# Altium schematic sheet SmartTokens Microcontroller.SchDoc: SmartTokens - Microcontroller
size A4; Author: Mathieu Le Goc; CompanyName: Inria - Aviz; DocumentNumber: 1; Revision: v1.0; SheetNumber: 1; SheetTotal: 2; PageSetup: Record=PageOptions|CenterHorizontal=True|CenterVertical=True|PrintScale=1.04|XCorrection=1.00|YCorrection=1.00|PrintKind=1|BorderSize=5000000|LeftOffset=0|BottomOffset=0|Orientation=2|PaperLength=1000|PaperWidth=1000|Scale=100|PaperSource=7|PrintQuality=-4|MediaType=1|DitherType=10|PrintScaleMode=1|PaperKind=A4|PaperIndex=9; ProjectName: SmartTokens
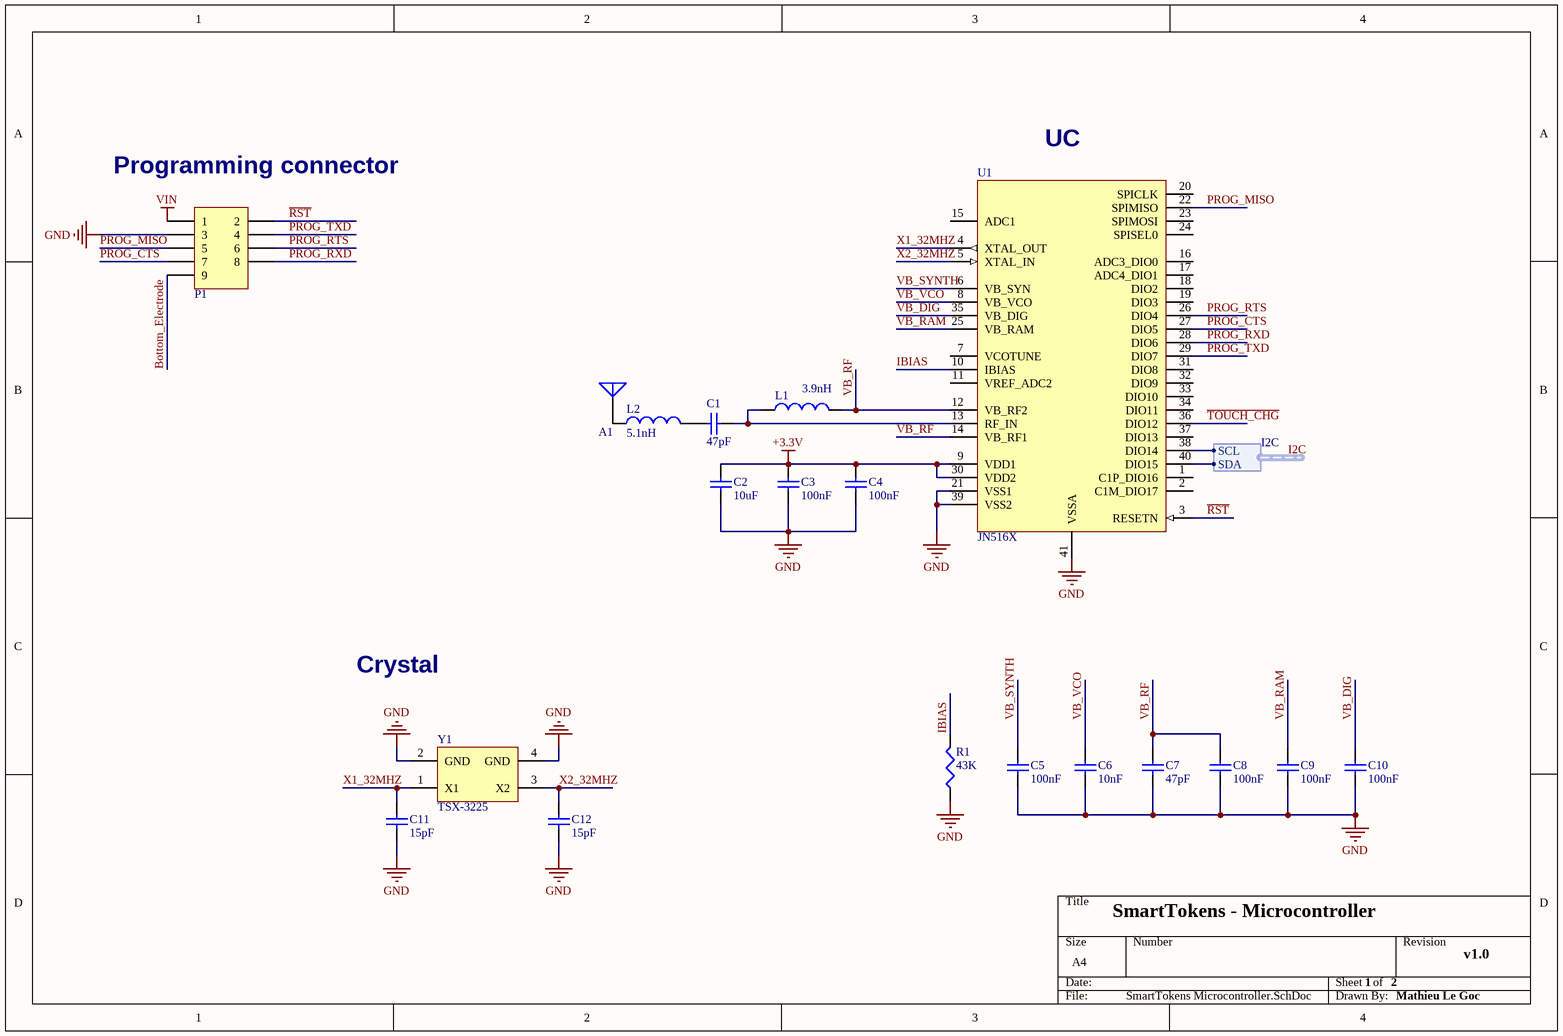
[diagram p0: SmartTokens Microcontroller.SchDoc]

## Parts
A1  2450AT18A100  [2450AT18A100]  (value not drawn)
C1  value 47pF  [0402]  (hidden comment: 47pF 0402 NP0 50V ±5%)
C2  value 10uF  [0603]  (hidden comment: 10uF 0603 X5R 6.3V ±20%)
C3  value 100nF  [0402]  (hidden comment: 100nF 0402 X7R 16V ±10%)
C4  value 100nF  [0402]  (hidden comment: 100nF 0402 X7R 16V ±10%)
C5  value 100nF  [0402]  (hidden comment: 100nF 0402 X7R 16V ±10%)
C6  10nF  [0402]
C7  value 47pF  [0402]  (hidden comment: 47pF 0402 NP0 50V ±5%)
C8  value 100nF  [0402]  (hidden comment: 100nF 0402 X7R 16V ±10%)
C9  value 100nF  [0402]  (hidden comment: 100nF 0402 X7R 16V ±10%)
C10  value 100nF  [0402]  (hidden comment: 100nF 0402 X7R 16V ±10%)
C11  value 15pF  [0402]  (hidden comment: 15pF 0402 NP0 50V ±5%)
C12  value 15pF  [0402]  (hidden comment: 15pF 0402 NP0 50V ±5%)
L1  value 3.9nH  [0402]  (hidden comment: 3.9NH  0402 MURATA)
L2  value 5.1nH  [0402]  (hidden comment: 5.1NH  0402 MURATA)
P1  HEADER 4X2+1 0.05"  [HEADER 4X2+1 0.05"]  (value not drawn)
R1  value 43K  [0402]  (hidden comment: 43K 0402 1/16W ±1%)
U1  JN516X  [QFN50P600X600X100_HS-41N]
Y1  TSX-3225  [TSX-3225]

## Harnesses
I2C: SDA, SCL

## Nets
+3.3V: C2.2 C3.2 C4.2 U1.9(VDD1) U1.30(VDD2)
GND: C2.1 C3.1 C4.1 C5.1 C6.1 C7.1 C8.1 C9.1 C10.1 C11.1 C12.1 P1.3 R1.1 U1.21(VSS1) U1.39(VSS2) U1.41(VSSA) Y1.2(GND) Y1.4(GND)
VIN: P1.1
Bottom_Electrode: P1.9
I2C.SCL: U1.38(DIO14) ; harness I2C.SCL
I2C.SDA: U1.40(DIO15) ; harness I2C.SDA
IBIAS: R1.2 U1.10(IBIAS)
PROG_CTS: P1.7 U1.27(DIO5)
PROG_MISO: P1.5 U1.22(SPIMISO)
PROG_RTS: P1.6 U1.26(DIO4)
PROG_RXD: P1.8 U1.28(DIO6)
PROG_TXD: P1.4 U1.29(DIO7)
~{RST}: P1.2 U1.3(RESETN)
~{TOUCH_CHG}: U1.36(DIO12)
VB_DIG: C10.2 U1.35(VB_DIG)
VB_RAM: C9.2 U1.25(VB_RAM)
VB_RF: C7.2 C8.2 L1.2 U1.12(VB_RF2) U1.14(VB_RF1)
VB_SYNTH: C5.2 U1.6(VB_SYN)
VB_VCO: C6.2 U1.8(VB_VCO)
X1_32MHZ: C11.2 U1.4(XTAL_OUT) Y1.1(X1)
X2_32MHZ: C12.2 U1.5(XTAL_IN) Y1.3(X2)
NetA1_1: A1.1(A) L2.1
NetC1_1: C1.1 L2.2
NetC1_2: C1.2 L1.1 U1.13(RF_IN)

Not connected (* = marked no-connect by the designer): U1 1(C1P_DIO16) 2(C1M_DIO17) 7(VCOTUNE) 11(VREF_ADC2) 15(ADC1) 16(ADC3_DIO0) 17(ADC4_DIO1) 18(DIO2) 19(DIO3) 20(SPICLK) 23(SPIMOSI) 24(SPISEL0) 31(DIO8) 32(DIO9) 33(DIO10) 34(DIO11) 37(DIO13)

## Notes on the sheet
- (near P1) Programming connector
- (near U1) UC
- Crystal

## Library data of the parts
A1 = 2450AT18A100: JOHANSON TECHNOLOGY  2450AT18A100E  ANTENNA, CERAMIC, 2.45GHZ; Supplier 1: Farnell; Supplier Part Number 1: 1885496; Supplier 2: Digi-Key; Supplier Part Number 2: 712-1005-1-ND
C1 C7 = 47pF: Supplier 1: Farnell; Supplier Part Number 1: 8819670; Supplier 2: Digi-Key; Supplier Part Number 2: 445-1243-1-ND
C2 = 10uF (cheap): Supplier 1: Farnell; Supplier Part Number 1: 1833804; Supplier 2: Digi-Key; Supplier Part Number 2: 478-5318-1-ND
C3-C5 C8-C10 = 100nF (cheap): Supplier 1: Farnell; Supplier Part Number 1: 1288252; Supplier 2: Digi-Key; Supplier Part Number 2: 399-3521-1-ND
C6 = 10nF: 10nF 0402 X7R 25V ±5%; Supplier 1: Farnell; Supplier Part Number 1: 1692285; Supplier 2: Digi-Key; Supplier Part Number 2: 399-1279-1-ND; Value: 10nF
C11 C12 = 15pF: Supplier 1: Farnell; Supplier Part Number 1: 1414577; Supplier 2: Digi-Key; Supplier Part Number 2: 399-1014-1-ND
L1 = 3.9NH 0402 ±0.1NH: MURATA - LQP15MN3N9B02D - 3.9NH ±0.1NH 0402; Supplier 1: Digi-Key; Supplier Part Number 1: 490-1131-1-ND
L2 = 5.1NH 0402 ±0.1NH: MURATA - LQP15MN5N1B02D - 5.1NH ±0.1NH 0402; Supplier 1: Digi-Key; Supplier Part Number 1: 490-6758-1-ND
R1 = 43K: Supplier 1: Farnell; Supplier Part Number 1: 1358086; Supplier 2: Digi-Key; Supplier Part Number 2: 541-43.0KLCT-ND
U1 = JN516X: IEEE802.15.4 Wireless Microcontroller; Supplier 1: Farnell; Supplier Part Number 1: 2341782
Y1 = TSX-3225: EPSON - TSX-3225, 32MHZ, 10PPM, 9PF - CRYSTAL, TSX-3225, 32MHZ, 10PPM, 9PF; Supplier 1: Farnell; Supplier Part Number 1: 1712845